# EAGLE design gpio4s2 (EAGLE 7.2.0)
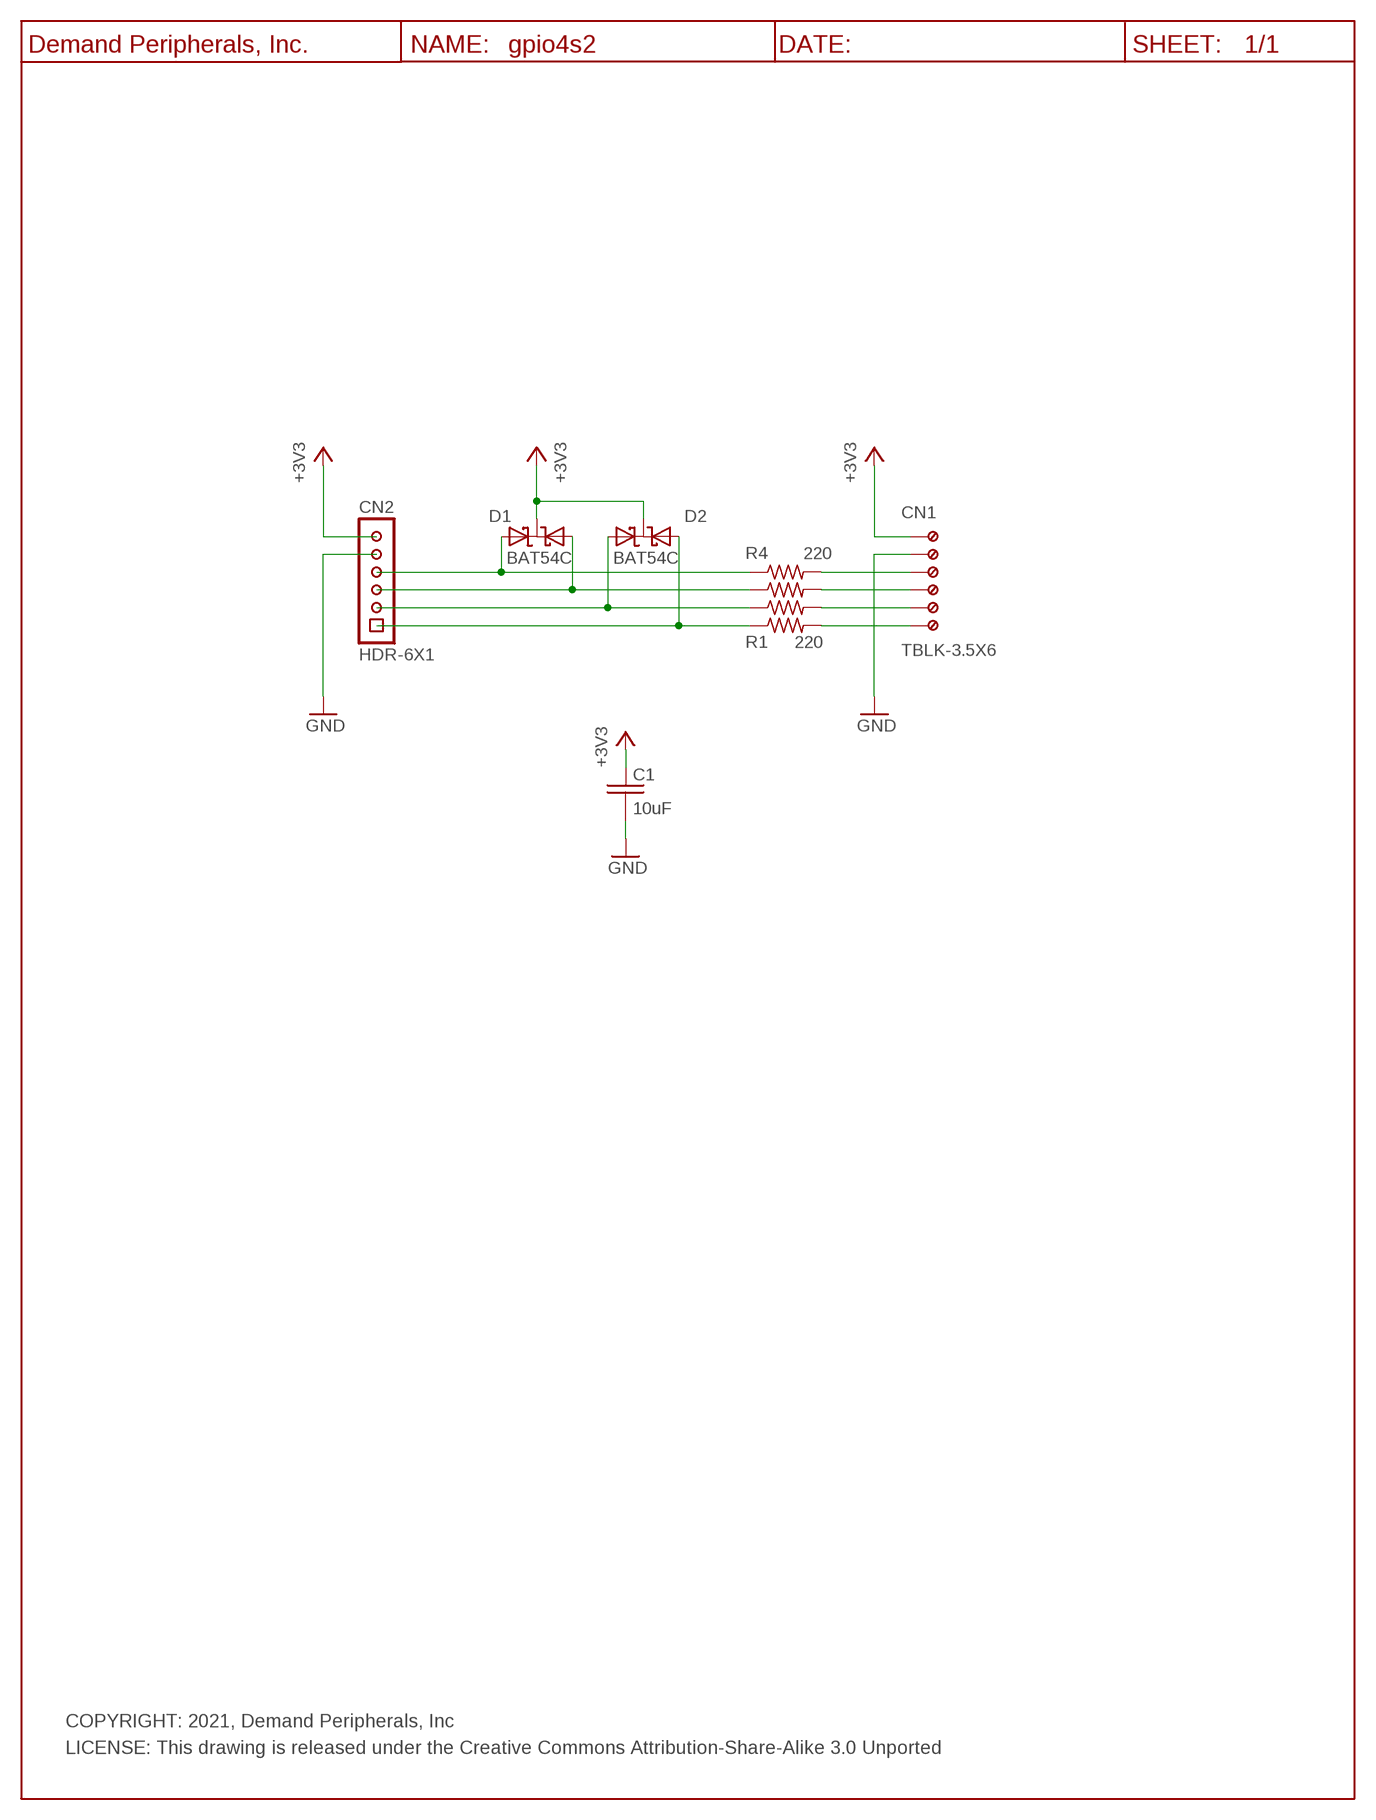
[diagram p0: schematic, sheet 1]

## Parts
C1  10uF  C10UF25V_C1206  [C1206]
CN1  TBLK-3.5X6  [TBLK-3.5X6]
CN2  HDR-6X1  [HDR-6X1]
D1  BAT54C  [SOT23]
D2  BAT54C  [SOT23]
R1  220  R220_R0603  [R0603]
R2  220  R220_R0603  [R0603]
R3  220  R220_R0603  [R0603]
R4  220  R220_R0603  [R0603]
U$1  DP_FRAME_P  [P_FRAME]

## Nets
+3V3: C1.1 CN1.1(KL) CN2.6 D1.3(CC) D2.3(CC)
GND: C1.2 CN1.2(KL1) CN2.5
N$1: CN1.3(KL2) R4.2
N$2: CN1.4(KL3) R3.2
N$3: CN1.5(KL4) R2.2
N$4: CN1.6(KL5) R1.2
N$11: CN2.4 D1.1(A1) R4.1
N$12: CN2.3 D1.2(A) R3.1
N$14: CN2.2 D2.1(A1) R2.1
N$15: CN2.1 D2.2(A) R1.1

## Notes on the sheet
- COPYRIGHT: 2021, Demand Peripherals, Inc
- LICENSE: This drawing is released under the Creative Commons Attribution-Share-Alike 3.0 Unported

## Library data of the parts
C1 = dpi-passive:C10UF25V_: 10 uF Capacitor, 25V, X7R; VENDOR: Digikey; VENDOR-PART-NUM: 1276-1804-2-ND
CN1 = dpi-conn:TBLK-3.5X6: Terminal block, 3.5mm, 6 position; VENDOR: Digikey; VENDOR-PART-NUM: ED2744-ND
CN2 = dpi-conn:HDR-6X1: 6x1 Pin header with pin 1 mark, no shroud, no lock; VENDOR: Digikey; VENDOR-PART-NUM: xxxxxxxxxx-ND
D1 D2 = dpi-diopto:BAT54C: BAT54C Dual Common Cathode Schottky; VENDOR: Digikey; VENDOR-PART-NUM: DB3X313N0LCT-ND
R1-R4 = dpi-passive:R220_: 220 Ohm resistor, 1%, 0.1 watt; VENDOR: Digikey; VENDOR-PART-NUM: 311-220HRTR-ND
U$1 = dpi-sym:DP_FRAME_P: Portrait/Letter Document Frame

## Board
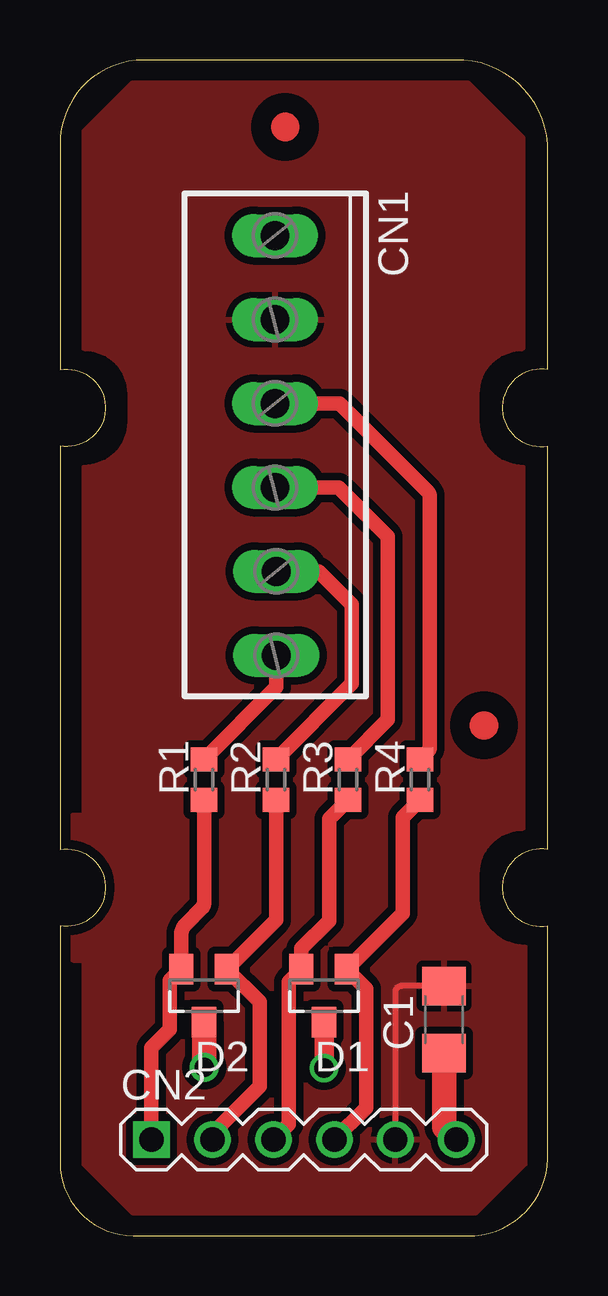
[diagram p1: board, top side]
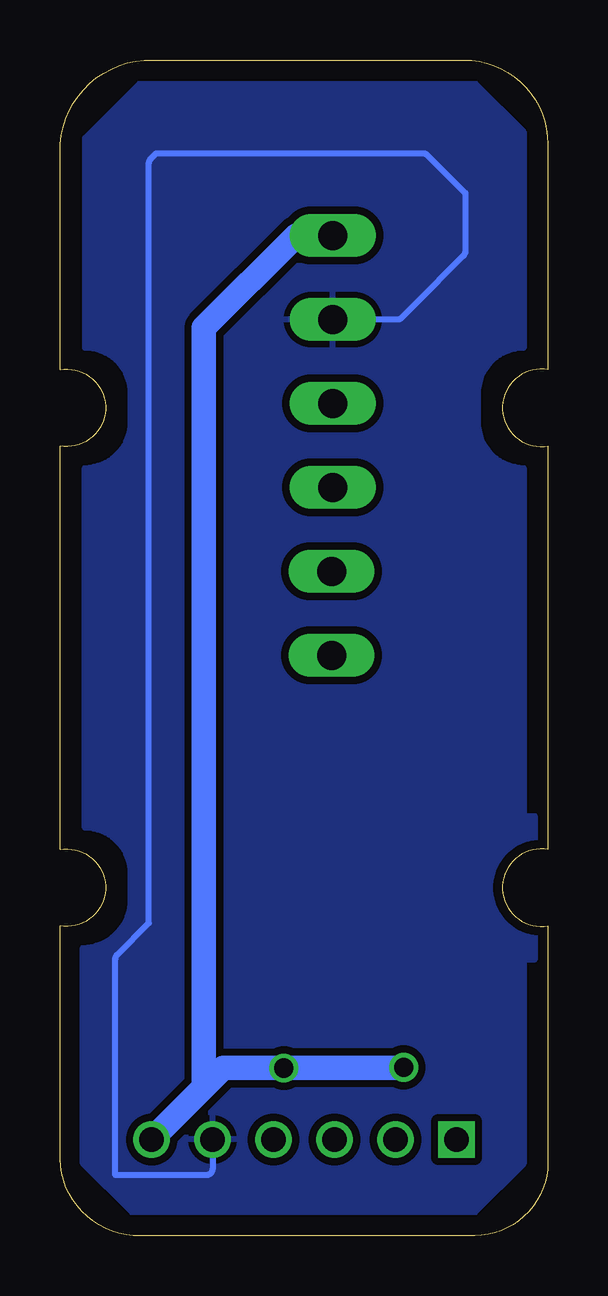
[diagram p2: board, bottom side, seen from below]

Size 20.33 x 49 mm. Coordinates in mm from the lower left corner, seen from the top.
Outline: 20.32,36.09 arc200 20.32,32.91 20.32,16.09 arc200 20.32,12.91 20.32,3.5 arc-90 17.27,0 3.05,0 arc-90 0,3.05 0,12.91 arc200 0,16.09 0,32.91 arc200 0,36.09 0,45.5 arc-90 3.5,49 16.82,49 arc-81 20.32,45.5 20.32,36.09
Copper layers (1*16): Top 0.035mm / dielectric 1.5mm / Bottom 0.035mm
Design rules "default *": minimum track width 10mil, minimum drill 24mil, track to track 12mil, track to pad 12mil, pad to pad 12mil, via to via 12mil, smd to smd 12mil, copper to edge 15mil, drill to drill 8mil, minimum pad ring 10mil, minimum via ring 8mil, stop-mask expansion 4mil, vias tented up to drill 0mil, thermal gap 10mil

### Footprints (pad centres in the part's own frame; a part is rotated, then mirrored left to right if it is on the bottom)
C1206 = smd 1.6 x 1.8: 1 -1.4,0; 2 1.4,0
TBLK-3.5X6 = drill 1.2 long: 1 -8.68,-0.04; 2 -5.18,-0.04; 3 -1.68,-0.04; 4 1.82,-0.04; 5 5.32,0.01; 6 8.82,0.01
HDR-6X1 = drill 1.016 square: 1 -6.35,0 | drill 1.016: 2 -3.81,0; 3 -1.27,0; 4 1.27,0; 5 3.81,0; 6 6.35,0
SOT23 = smd 1.016 x 1.27: 1 -0.95,-1.1; 2 0.95,-1.1; 3 0,1.1
R0603 = smd 1 x 1.1: 1 -0.85,0; 2 0.85,0

### Placement (x,y rotation side)
C1  16,9 90 top
CN1  9,33 270 top
CN2  10.16,4 0 top
D1  11,10 180 top
D2  6,10 180 top
R1  6,19 90 top
R2  9,19 90 top
R3  12,19 90 top
R4  15,19 90 top
U$1  -2.54,-2.54 0 top
U$2  [DPI-2]  4.71,45 90 bottom
U$3  [FIDUCIAL]  9.38,46.21 0 top
U$8  [FIDUCIAL]  17.67,21.27 0 top

### Tracks (layer width: path | path; a pad name or v marks a point on that pad's centre or on a via)
+3V3  (via drill 0.8)
  Top 0.813: v11,6.98 D1.3
  Top 1.016: D2.3 v6,7.02 v6.01,7.01 | C1.1 16,4.51 CN2.6
  Bottom 0.813: v6.01,7.01 6.03,7
  Bottom 1.016: 14.33,6.18 14.33,37.84 10.49,41.68 CN1.1 | CN2.6 14.33,6.18 | 14.33,6.18 13.53,6.98 v11,6.98 6.03,7
GND
  Top 0.254: C1.2 14.22,10.4 arc90 13.97,10.15 CN2.5
  Bottom 0.254: CN2.5 13.97,2.77 arc90 14.22,2.52 18.02,2.52 18.02,11.53 arc45 17.95,11.7 16.62,13.03 16.62,44.7 arc45 16.55,44.88 16.32,45.11 5.21,45.11 arc45 5.03,45.04 3.44,43.45 3.44,41.02 arc45 3.51,40.84 5.58,38.77 6.1,38.25 arc45 6.28,38.18 CN1.2
  pour Top: 1.01,2.99 3.04,0.96 17.32,0.96 19.37,3.01 19.37,12 arc-90 17.37,14 17.37,15.08 arc-90 19.29,17 19.29,32 arc-90 17.37,33.92 17.37,35.09 arc-90 19.28,37 19.28,45.75 17.01,48.02 3.02,48.02 1.01,46.01 1.01,37 arc-90 2.92,35.09 2.92,33.91 arc-90 1.01,32 1.01,17.5 0.55,17.5 0.55,11.5 1,11.5
  pour Bottom: 1.01,2.99 3.04,0.96 17.32,0.96 19.37,3.01 19.37,12 arc-90 17.37,14 17.37,15.08 arc-90 19.29,17 19.29,32 arc-90 17.37,33.92 17.37,35.09 arc-90 19.28,37 19.28,45.75 17.01,48.02 3.02,48.02 1.01,46.01 1.01,37 arc-90 2.92,35.09 2.92,33.91 arc-90 1.01,32 1.01,17.5 0.55,17.5 0.55,11.5 1,11.5
N$1
  Top 0.61: CN1.3 11.65,34.68 12.3,34.03 15,31.33 15.33,31 arc-45 15.4,30.82 15.4,21.39 15.4,20.36 arc-45 15.33,20.18 R4.2
N$2
  Top 0.61: R3.2 13.66,21.51 13.66,29.14 11.62,31.18 CN1.4
N$3
  Top 0.61: R2.2 12.16,23.01 12.16,26.31 10.79,27.68 CN1.5
N$4
  Top 0.61: R1.2 9.01,22.86 CN1.6
N$11
  Top 0.61: R4.1 14.28,17.43 14.28,16.6 14.28,13.43 D1.1 12.76,10.29 12.76,9.74 12.76,5.33 CN2.4
N$12
  Top 0.61: CN2.3 9.53,4.64 9.53,8.8 9.53,10.58 D1.2 10.06,11.96 11.22,13.12 11.21,17.36 R3.1
N$14
  Top 0.61: CN2.2 6.35,4.24 8.32,6.21 8.32,9.73 D2.1 9,13.15 R2.1
N$15
  Top 0.61: CN2.1 3.81,7.83 4.58,8.6 4.58,10.63 D2.2 5.05,12.53 arc-45 5.24,12.98 5.93,13.67 arc45 6,13.84 R1.1

### Text on the board
tTest: 0.8 in | 20 mm | (C) 2021, Demand Peripherals, Inc. | CN1 | 33 | Rev 21A | Gnd | 4 | 3 | 20 mm | 49 mm | 2 | 1 | GPIO4s2, | R1 | R2 | R3 | R4 | D2 | D1 | C1 | CN2